# Altium project Interface Board V0.PrjPcb
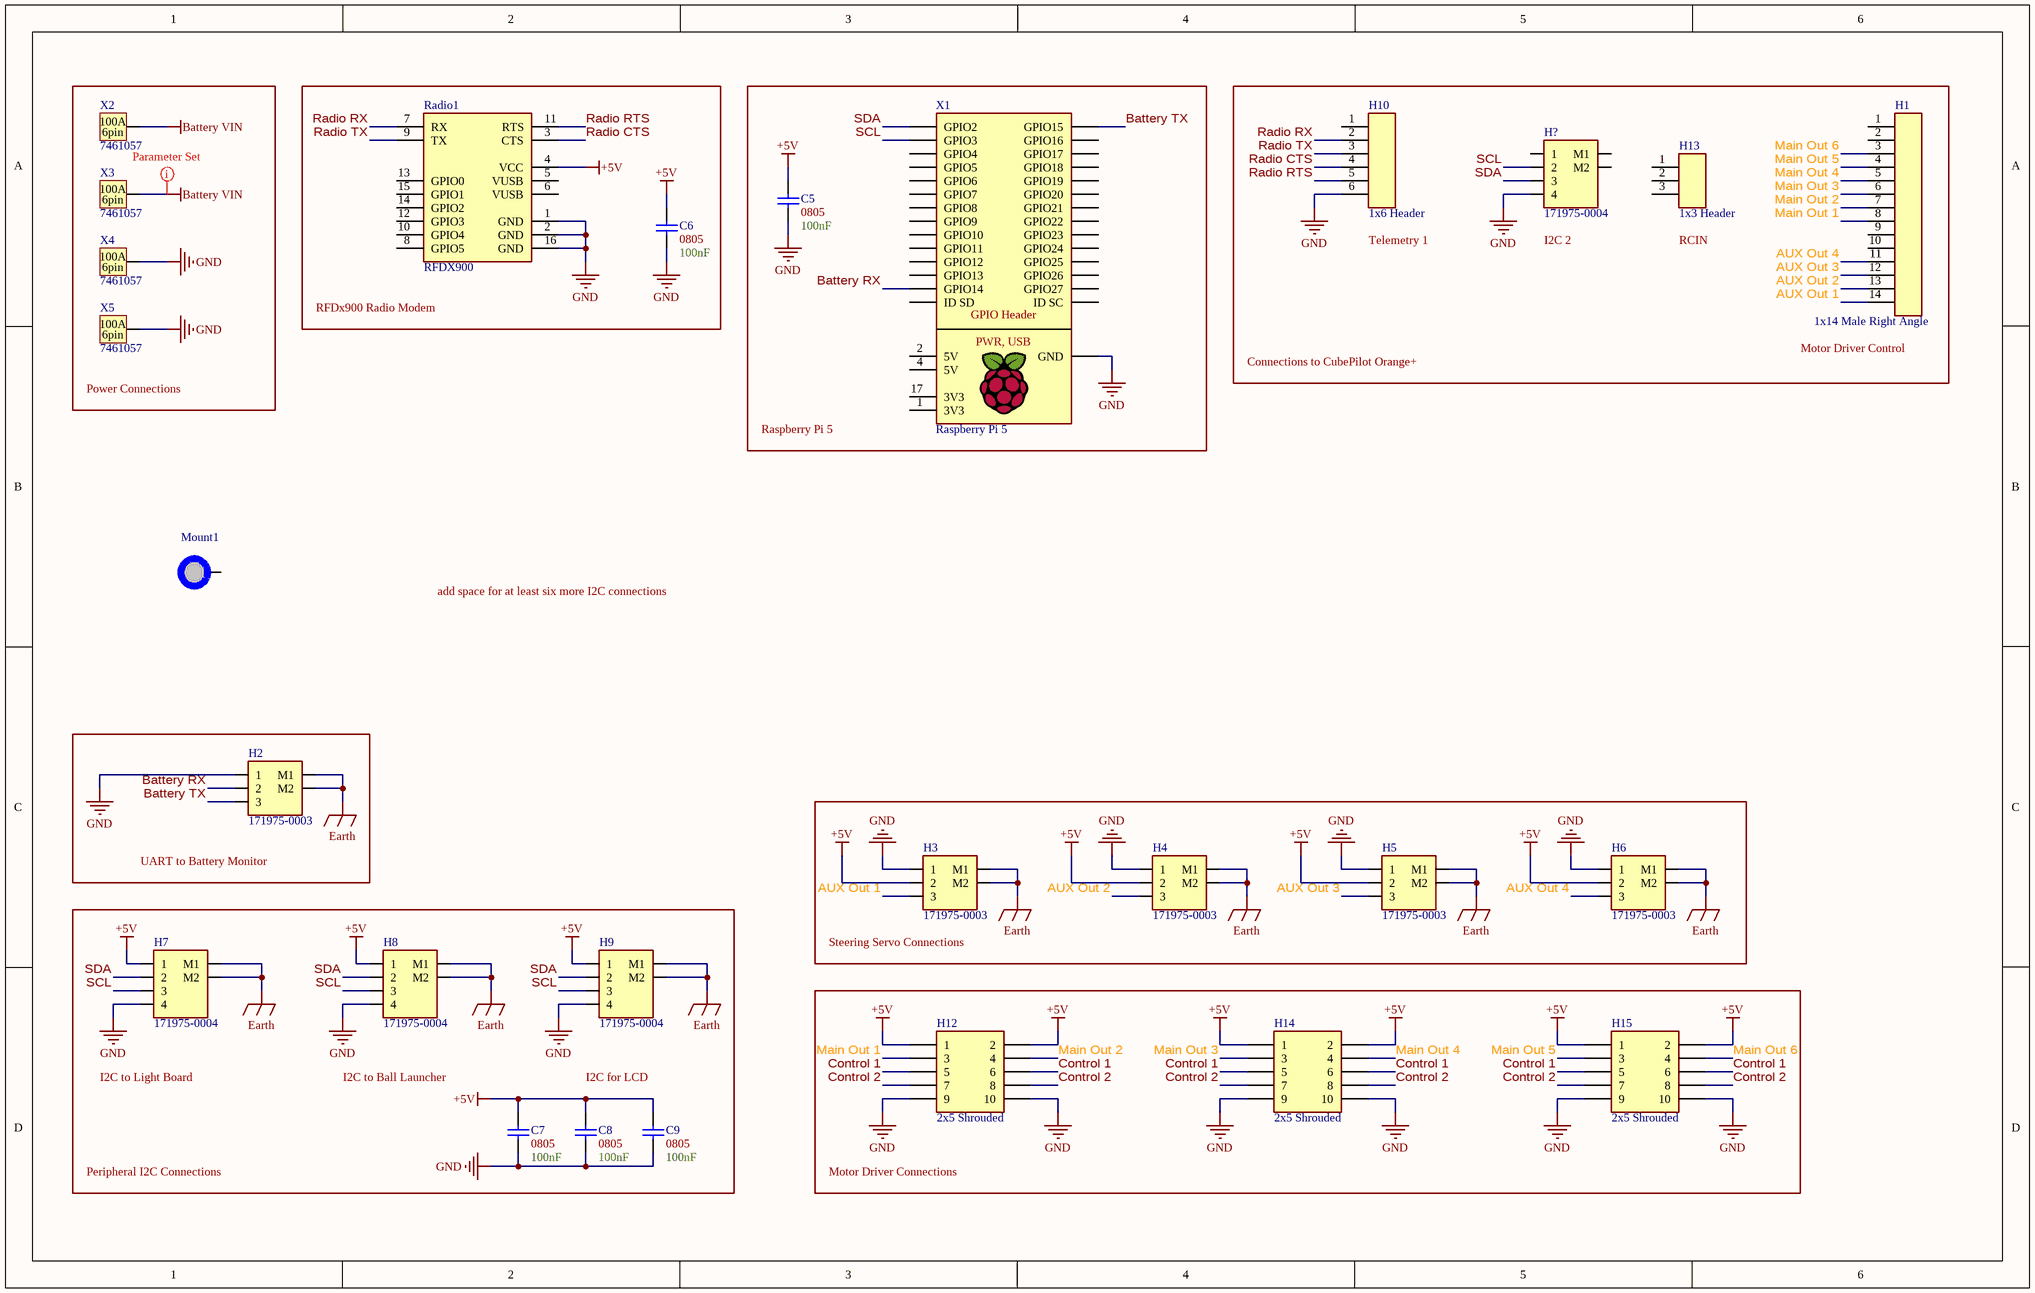
[diagram p0: Devices.SchDoc]
2 sheets, 34 parts. Net scope: global (net labels, ports and power ports of the same name join across sheets).
Board file: main.PcbDoc
Sheets:
  Devices.SchDoc
  Power.SchDoc

## Sheet Devices.SchDoc
size B; SheetNumber: 1; SheetTotal: 2

### Parts
C5  Size Package: 0805  Capacitance: 100nF  [[Cap] SMD 0805]  (hidden comment: SMD Nonpolarized)
C6  Size Package: 0805  Capacitance: 100nF  [[Cap] SMD 0805]  (hidden comment: SMD Nonpolarized)
C7  Size Package: 0805  Capacitance: 100nF  [[Cap] SMD 0805]  (hidden comment: SMD Nonpolarized)
C8  Size Package: 0805  Capacitance: 100nF  [[Cap] SMD 0805]  (hidden comment: SMD Nonpolarized)
C9  Size Package: 0805  Capacitance: 100nF  [[Cap] SMD 0805]  (hidden comment: SMD Nonpolarized)
H1  1x14 Male Right Angle  [[Header] 1x14 Right Angle Male]
H2  171975-0003  [[Header] Shrouded 1x3 Right Angle Male]
H3  171975-0003  [[Header] Shrouded 1x3 Right Angle Male]
H4  171975-0003  [[Header] Shrouded 1x3 Right Angle Male]
H5  171975-0003  [[Header] Shrouded 1x3 Right Angle Male]
H6  171975-0003  [[Header] Shrouded 1x3 Right Angle Male]
H7  171975-0004  [[Header] Shrouded 1x4 Right Angle Male]
H8  171975-0004  [[Header] Shrouded 1x4 Right Angle Male]
H9  171975-0004  [[Header] Shrouded 1x4 Right Angle Male]
H10  1x6 Header  [[Header] 1x6 Male]
H12  2x5 Shrouded  [[Header] Shrouded 2x5 Male]
H13  1x3 Header  [[Header] 1x3 Male]
H14  2x5 Shrouded  [[Header] Shrouded 2x5 Male]
H15  2x5 Shrouded  [[Header] Shrouded 2x5 Male]
H?  171975-0004  [[Header] Shrouded 1x4 Right Angle Male]
Mount1  M3 Mount Hole  [[Mount] M3 Mount Hole]  (value not drawn)  (no BOM)
Radio1  RFDX900  [[Device] RFDX900 Radio]
X1  Raspberry Pi 5  [[Device] Raspberry Pi 5]
X2  7461057  [[Port] Shank Connector (100A)]
X3  7461057  [[Port] Shank Connector (100A)]
X4  7461057  [[Port] Shank Connector (100A)]
X5  7461057  [[Port] Shank Connector (100A)]

### Blocks framed on the sheet
Power Connections: X2-X5
RFDx900 Radio Modem: C6 Radio1
Raspberry Pi 5: C5 X1
UART to Battery Monitor: H2
Steering Servo Connections: H3-H6
Motor Driver Connections: H12 H14 H15

### Nets
+5V: C5.1 C6.1 C7.2 C8.2 C9.2 H3.2 H4.2 H5.2 H6.2 H7.1 H8.1 H9.1 H12.1 H12.2 H14.1 H14.2 H15.1 H15.2 Radio1.4(VCC)
Battery VIN: X2.1 X3.1
Earth: H2.MH1(M1) H2.MH2(M2) H3.MH1(M1) H3.MH2(M2) H4.MH1(M1) H4.MH2(M2) H5.MH1(M1) H5.MH2(M2) H6.MH1(M1) H6.MH2(M2) H7.MH1(M1) H7.MH2(M2) H8.MH1(M1) H8.MH2(M2) H9.MH1(M1) H9.MH2(M2)
GND: C5.2 C6.2 C7.1 C8.1 C9.1 H2.1 H3.1 H4.1 H5.1 H6.1 H7.4 H8.4 H9.4 H10.6 H12.9 H12.10 H14.9 H14.10 H15.9 H15.10 H?.4 Radio1.1(GND) Radio1.2(GND) Radio1.16(GND) X1.GND X4.1 X5.1
AUX Out 1: H1.14 H3.3
AUX Out 2: H1.13 H4.3
AUX Out 3: H1.12 H5.3
AUX Out 4: H1.11 H6.3
Battery RX: H2.2 X1.8(GPIO14)
Battery TX: H2.3 X1.10(GPIO15)
Control 1: H12.5 H12.6 H14.5 H14.6 H15.5 H15.6
Control 2: H12.7 H12.8 H14.7 H14.8 H15.7 H15.8
Main Out 1: H1.8 H12.3
Main Out 2: H1.7 H12.4
Main Out 3: H1.6 H14.3
Main Out 4: H1.5 H14.4
Main Out 5: H1.4 H15.3
Main Out 6: H1.3 H15.4
Radio CTS: H10.4 Radio1.3(CTS)
Radio RTS: H10.5 Radio1.11(RTS)
Radio RX: H10.2 Radio1.7(RX)
Radio TX: H10.3 Radio1.9(TX)
SCL: H7.3 H8.3 H9.3 H?.2 X1.5(GPIO3)
SDA: H7.2 H8.2 H9.2 H?.3 X1.3(GPIO2)

Not connected (* = marked no-connect by the designer): H1 1 2 9 10; H10 1; H13 1 2 3; H? 1 MH1(M1) MH2(M2); Mount1 1; Radio1 5(VUSB) 6(VUSB) 8(GPIO5) 10(GPIO4) 12(GPIO3) 13(GPIO0) 14(GPIO2) 15(GPIO1); X1 1(3V3) 2(5V) 4(5V) 7(GPIO4) 11(GPIO17) 12(GPIO18) 13(GPIO27) 15(GPIO22) 16(GPIO23) 17(3V3) 18(GPIO24) 19(GPIO10) 21(GPIO9) 22(GPIO25) 23(GPIO11) 24(GPIO7) 26(GPIO8) 27(ID_SD) 28(ID_SC) 29(GPIO5) 31(GPIO6) 32(GPIO12) 33(GPIO13) 35(GPIO19) 36(GPIO16) 37(GPIO26) 38(GPIO20) 40(GPIO21)

### Layout directives
net class Motor VOUT: Battery VIN

### Notes on the sheet
- (near H10) Telemetry 1
- (near H?) I2C 2
- (near H13) RCIN
- Connections to CubePilot Orange+
- (near H1) Motor Driver Control
- add space for at least six more I2C connections
- I2C to Light Board
- I2C to Ball Launcher
- I2C for LCD
- Peripheral I2C Connections
- (in symbol [Device] Raspberry Pi 5) GPIO Header; PWR, USB
- (in symbol [Port] Shank Connector (100A)) 100A; 6pin

### Library data of the parts
C5-C9 = [Cap] SMD Nonpolarized
H1 = [Header] 1x14 Right Angle Male: 2.54mm pitch
H2-H6 = [Header] Shrouded 1x3 Right Angle Male: 171975-0003 / Mates with 0050579403
H7-H9 H? = [Header] Shrouded 1x4 Right Angle Male: 171975-0004 / Mates with 0050579404
H10 = [Header] 1x6 Male: 2.54mm pitch
H12 H14 H15 = [Header] Shrouded 2x5 Male: BHR-10-VUA
H13 = [Header] 1x3 Male: 2.54mm pitch
Mount1 = [Mount] M3 Mount Hole: Place at least 4.5mm from board edge. Plated.
Radio1 = [Device] RFDX900 Radio: RFDX900 Long-Range RF Module
X1 = [Device] Raspberry Pi 5
X2-X5 = [Port] Shank Connector (100A): 7461057, internal thread

## Sheet Power.SchDoc
size A; SheetNumber: 2; SheetTotal: 2
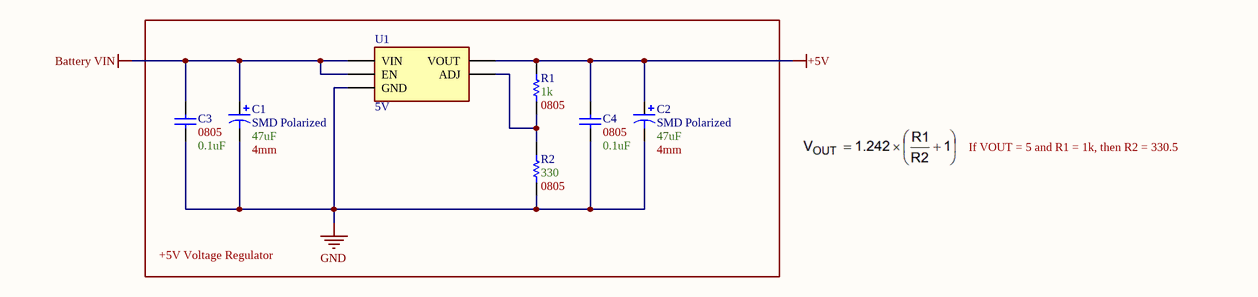
[diagram p1: Power.SchDoc]

### Parts
C1  SMD Polarized  Capacitance: 47uF  Diameter: 4mm  [[Cap] SMD Polarized, 4mm]
C2  SMD Polarized  Capacitance: 47uF  Diameter: 4mm  [[Cap] SMD Polarized, 4mm]
C3  Size Package: 0805  Capacitance: 0.1uF  [[Cap] SMD 0805]  (hidden comment: SMD Nonpolarized)
C4  Size Package: 0805  Capacitance: 0.1uF  [[Cap] SMD 0805]  (hidden comment: SMD Nonpolarized)
R1  Resistance: 1k  Size Package: 0805  [[Res] SMD 0805]  (hidden comment: [Res] SMD Resistor)
R2  Resistance: 330  Size Package: 0805  [[Res] SMD 0805]  (hidden comment: [Res] SMD Resistor)
U1  5V  [[Reg] Variable Voltage Regulator]

### Blocks framed on the sheet
+5V Voltage Regulator: C1-C4 R1 R2 U1

### Nets
+5V: C2.1 C4.2 R1.2 U1.4(VOUT)
Battery VIN: C1.1 C3.2 U1.1(EN) U1.2(VIN)
GND: C1.2 C2.2 C3.1 C4.1 R2.1 U1.3(GND)
NetR1_1: R1.1 R2.2 U1.5(ADJ)

### Notes on the sheet
- If VOUT = 5 and R1 = 1k, then R2 = 330.5

### Library data of the parts
C1 C2 = [Cap] SMD Polarized: JLC Part #: *; Mouser Part #: *
C3 C4 = [Cap] SMD Nonpolarized
U1 = [Reg] Variable Voltage Regulator: MIC29302WT

## Nets that join several sheets
+5V: Devices (19 pins), Power (C2.1 C4.2 R1.2 U1.4)
Battery VIN: Devices (X2.1 X3.1), Power (C1.1 C3.2 U1.1 U1.2)
GND: Devices (27 pins), Power (6 pins)